# EasyEDA Pro project ProPrj_有源带通滤波器_2025-07-17.epro

# Schematic Schematic1
Board Name: Board1; Create Date: 2025-07-17; Page Name: P1; Project Name: 有源带通滤波器; Schematic Name: Schematic1; Update Date: 2025-07-17; Company: 嘉立创EDA; Page Size: A4; Version: V1.0
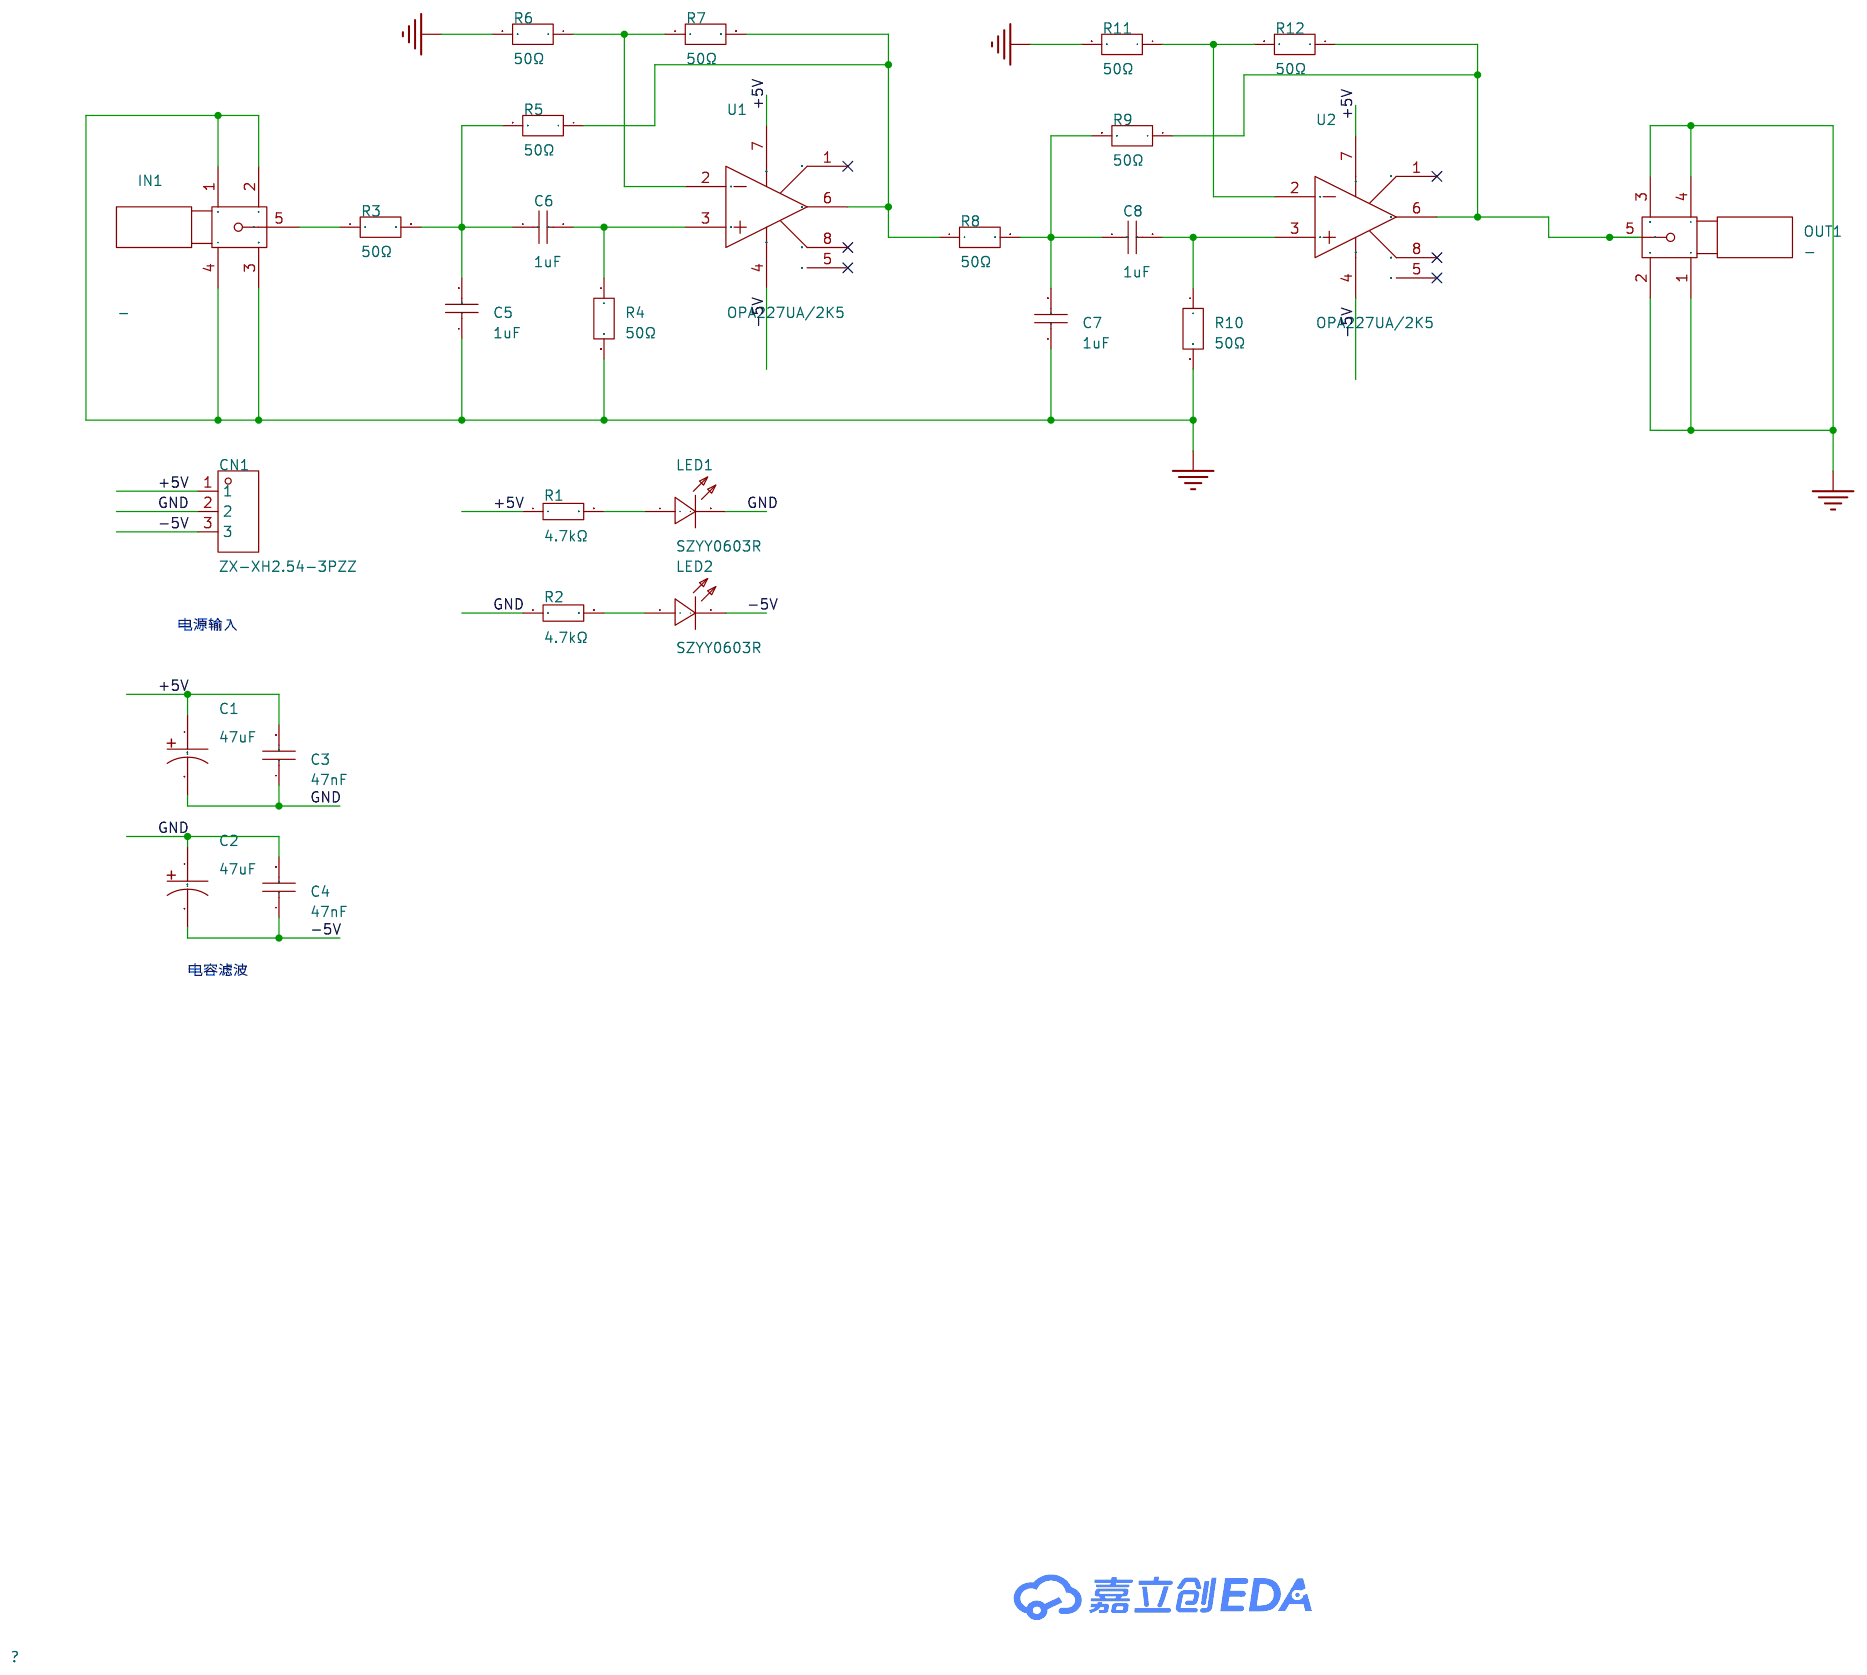
[diagram p0: schematic sheet]

## Parts
C1  47uF  [CAP-TH_BD5.0-P2.00-D0.8-FD]
C2  47uF  [CAP-TH_BD5.0-P2.00-D0.8-FD]
C3  47nF  [C0805]
C4  47nF  [C0805]
C5  1uF  [C0805]
C6  1uF  [C0805]
C7  1uF  [C0805]
C8  1uF  [C0805]
CN1  ZX-XH2.54-3PZZ  [CONN-TH_3P-P2.54_2501S-3P]
IN1  -  [SMA-SMD_BWSMA-KE-P001]
LED1  SZYY0603R  [LED0603-R-RD]
LED2  SZYY0603R  [LED0603-R-RD]
OUT1  -  [SMA-SMD_BWSMA-KE-P001]
R1  4.7kΩ  [R0805]
R2  4.7kΩ  [R0805]
R3  50Ω  [R0805]
R4  50Ω  [R0805]
R5  50Ω  [R0805]
R6  50Ω  [R0805]
R7  50Ω  [R0805]
R8  50Ω  [R0805]
R9  50Ω  [R0805]
R10  50Ω  [R0805]
R11  50Ω  [R0805]
R12  50Ω  [R0805]
U1  OPA227UA/2K5  [SOIC-8_L4.9-W3.9-P1.27-LS6.0-BL]
U2  OPA227UA/2K5  [SOIC-8_L4.9-W3.9-P1.27-LS6.0-BL]

## Library data of the parts
C1 C2 = NXB25V47M5*11 2.5TP: 容值:47uF;精度:±20%;额定电压:25V;纹波电流:250mA@100kHz;等效串联电阻(ESR):300mΩ@100kHz;; LCSC Part Name: 47uF ±20% 25V; Supplier Part: C371230; Manufacturer: SAMYOUNG(韩国三莹); Supplier Footprint: 插件,D5xL11mm; JLCPCB Part Class: 扩展库; Datasheet: https://atta.szlcsc.com/upload/public/pdf/source/20190227/C371244_FA85FFEFC2961227CF12E3CCE8C34A7D.pdf; Supplier: LCSC; Tolerance: ±20%; Voltage Rating: 25V; Ripple Current: 250mA@100kHz; Equivalent Series Resistance(ESR): 300mΩ@100kHz; Pin Spacing: 2mm; Diameter: 5mm; Height - Seated (Max): 11mm; Lifetime: 2000hrs@105℃; Operating Temperature: -40℃~+105℃
C3 C4 = CL21B473KBCNNNC: 容值:47nF;精度:±10%;额定电压:50V;材质(温度系数):X7R;; LCSC Part Name: 47nF ±10% 50V; Supplier Part: C53134; Manufacturer: SAMSUNG(三星); Supplier Footprint: 0805; JLCPCB Part Class: 基础库; Datasheet: https://atta.szlcsc.com/upload/public/pdf/source/20160218/1457707763339.pdf; Supplier: LCSC; Tolerance: ±10%; Voltage Rated: 50V; Temperature Coefficient: X7R
C5-C8 = CL21B105KBFNNNE: 容值:1uF;精度:±10%;额定电压:50V;材质(温度系数):X7R;; LCSC Part Name: 1uF ±10% 50V; Supplier Part: C28323; Manufacturer: SAMSUNG(三星); Supplier Footprint: 0805; JLCPCB Part Class: 基础库; Datasheet: https://atta.szlcsc.com/upload/public/pdf/source/20160218/1457707763339.pdf; Supplier: LCSC; Tolerance: ±10%; Voltage Rated: 50V; Temperature Coefficient: X7R
CN1 = ZX-XH2.54-3PZZ: 插针结构:1x3P;间距:2.5mm;安装方式:直插;参考系列:XH;总PIN数:3P;排数:1;每排PIN数:3;行距:-;额定电流:3A;触头材质:黄铜;触头镀层:锡;工作温度范围:-25℃~+85℃;; LCSC Part Name: 1x3P 间距:2.5mm 直插 系列:XH; Supplier Part: C7429633; Manufacturer: Megastar(兆星); Supplier Footprint: 插件,P=2.5mm; JLCPCB Part Class: 扩展库; Datasheet: https://atta.szlcsc.com/upload/public/pdf/source/20230619/AE17037A2CFDBE8D9CBA775D61AD0A84.pdf; Supplier: LCSC; Pins Structure: 1x3P; Pitch: 2.5mm; Mounting Type: 直插; Reference Series: XH; Number of Pins: 3P; Number of Rows: 1; Number of PINs Per Row: 3; Rated Current: 3A; Contact Material: 黄铜; Contact Plating: 锡; Operating Temperature: -25℃~+85℃; Rated Voltage (Max): 250V; Plastic Material: PA66; Flame Retardant Rating: UL94V-0; Color: 白色; Z-Height of the Board: 7mm; X-Length of Bottom Edge on Board (Spacing Line): 10mm; Y-Width of Bottom Edge on Board: 5.9mm
IN1 OUT1 = BWSMA-KE-P001: 连接器类型:板端;接口类型:内孔;端口数量:1;接口直径:5.2mm;接口长度/高度:-;频率:-;射频系列:SMA;阻抗:50Ω;样式:偏脚;工作温度:-;; LCSC Part Name: 内孔 SMA 偏脚; Supplier Part: C496550; Manufacturer: BAT WIRELESS(蝙蝠无线); Supplier Footprint: SMD; JLCPCB Part Class: 扩展库; Datasheet: https://atta.szlcsc.com/upload/public/pdf/source/20240320/28FD502871C976DFF213ABFCF2A0ED51.pdf; Supplier: LCSC; Connector Type: 板端; Interface: 内孔; Number of Ports: 1; Interface Diameter: 5.2mm; RF Series: SMA; Impedance: 50Ω; Style: 偏脚
LED1 LED2 = SZYY0603R: 发光颜色:红色;功率:40mW;正向电流:20mA;主波长:615nm~630nm;二极管配置:-;透镜颜色:无色透明透镜;色温:-;发光角度:120°;载带方式:-;工作温度:-40℃~+85℃;; LCSC Part Name: 红灯; Supplier Part: C434419; Manufacturer: yongyu(永裕光电); Supplier Footprint: 0603; JLCPCB Part Class: 扩展库; Datasheet: https://atta.szlcsc.com/upload/public/pdf/source/20191204/C434419_0B955C1F73FF88449D9A795B6FF49070.pdf; Supplier: LCSC; Emitted Color: 红色; Power Dissipation: 40mW; Forward Current: 20mA; Dominant Wavelength: 615nm~630nm; Peak Wavelength: 645nm; Lens Color: 无色透明透镜; Viewing Angle: 120°; Operating Temperature: -40℃~+85℃
R1 R2 = 0805W8F4701T5E: 电阻类型:厚膜电阻;阻值:4.7kΩ;精度:±1%;功率:125mW;最大工作电压:150V;温度系数:±100ppm/℃;; LCSC Part Name: 4.7kΩ ±1% 125mW 厚膜电阻; Supplier Part: C17673; Manufacturer: UNI-ROYAL(厚声); Supplier Footprint: 0805; JLCPCB Part Class: 基础库; Datasheet: https://atta.szlcsc.com/upload/public/pdf/source/20200306/C422600_1E6D84923E4A46A82E41ADD87F860B5C.pdf; Supplier: LCSC; Type: 厚膜电阻; Tolerance: ±1%; Power(Watts): 125mW; Overload Voltage (Max): 150V; Temperature Coefficient: ±100ppm/℃; Operating Temperature Range: -55℃~+155℃
R3-R12 = TD05G50R0BT: 电阻类型:薄膜电阻;阻值:50Ω;精度:±0.1%;功率:100mW;温度系数:±25ppm/℃;; LCSC Part Name: 薄膜电阻 50Ω ±0.1% 100mW; Supplier Part: C5355206; Manufacturer: FH(风华); Supplier Footprint: 0805; JLCPCB Part Class: 扩展库; Datasheet: https://atta.szlcsc.com/upload/public/pdf/source/20220726/97950D08E3EA8CC4F1F63A0C564F66E4.pdf; Supplier: LCSC; Type: 薄膜电阻; Tolerance: ±0.1%; Power(Watts): 100mW; Temperature Coefficient: ±25ppm/℃
U1 U2 = OPA227UA/2K5: 放大器数:单路;增益带宽积(GBP):8MHz;输入偏置电流(Ib):2.5nA;压摆率(SR):2.3V/us;轨到轨:-;; Supplier Part: C456278; Manufacturer: TI(德州仪器); Supplier Footprint: SOIC-8; JLCPCB Part Class: 扩展库; Datasheet: https://www.ti.com/cn/lit/gpn/opa227; Supplier: LCSC; Number of Channels: 单路; Gain Bandwidth Product: 8MHz; Ib - Input Bias Current: 2.5nA; Slew Rate: 2.3V/us; Output Current: 45mA; Operating Temperature: -40℃~+85℃

## Nets
+5V: C1.1 C3.2 CN1.1 R1.1 U1.7(VCC) U2.7(VCC)
-5V: C2.2 C4.1 CN1.3 LED2.2(-) U1.4(VSS) U2.4(VSS)
GND: C1.2 C2.1 C3.1 C4.2 C5.1 C7.1 CN1.2 IN1.1 IN1.2 IN1.3 IN1.4 LED1.2(-) OUT1.1 OUT1.2 OUT1.3 OUT1.4 R2.1 R4.2 R6.2 R10.2 R11.2
$1N803: C5.2 C6.1 R3.2 R5.2
$1N814: LED1.1(+) R1.2
$1N823: LED2.1(+) R2.2
$1N1510: C7.2 C8.1 R8.2 R9.2
Net-(C6-2): C6.2 R4.1 U1.3(VIN+)
Net-(C8-2): C8.2 R10.1 U2.3(VIN+)
Net-(IN1-5): IN1.5 R3.1
Net-(OUT1-5): OUT1.5 R9.1 R12.1 U2.6(OUT)
Net-(R5-1): R5.1 R7.2 R8.1 U1.6(OUT)
Net-(R6-1): R6.1 R7.1 U1.2(VIN-)
Net-(R11-1): R11.1 R12.2 U2.2(VIN-)

Not connected (* = marked no-connect by the designer): U1 1(TRIM)* 5(NC)* 8(TRIM)*; U2 1(TRIM)* 5(NC)* 8(TRIM)*

## Notes on the sheet
- 电源输入
- 电容滤波

# Board PCB1
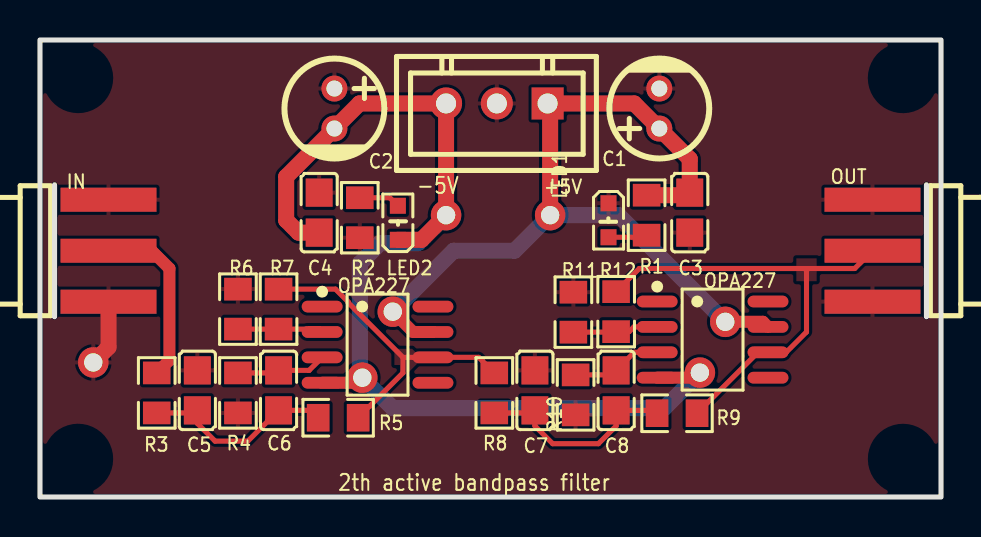
[diagram p1: board, top side]
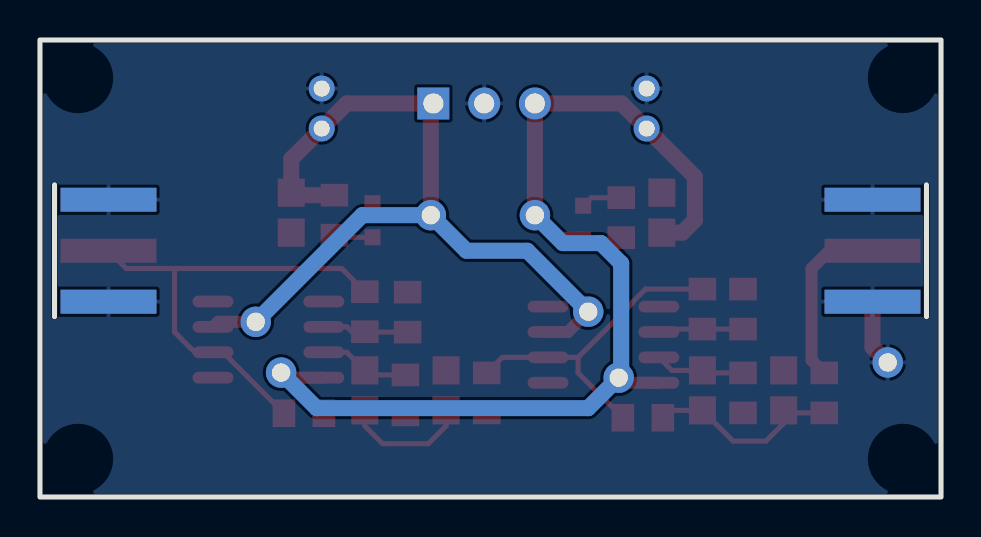
[diagram p2: board, bottom side, seen from below]

Outline 45.09 x 22.86 mm; copper layers: Top Layer, Bottom Layer. Coordinates in mm from the lower left corner of the outline.
Outline path: rectangle 0,22.86 45.09,0
Stack: Top Layer 0.035mm / Dielectric1 1.51mm FR4 er 4.5 / Bottom Layer 0.035mm

## Design rules (mm)
template: JLCPCB Capability(Two Layers Board)
spacing copperThickness1oz (default): track to track 0.102, other pairs 0.152 to 0.3
spacing copperThickness2oz: track to track 0.203, other pairs 0.152 to 0.3
track width copperThickness1oz (default): min 0.127, default 0.254, max 2.54
track width copperThickness2oz: min 0.203, default 0.254, max 2.54
differential pair differentialPair (default): width min 0.127, default 0.254, max 2.54; gap min 0.152, default 0.152
via viaSize (default): diameter min 0.5, default 0.61, max 10; hole min 0.3, default 0.305, max 6.3

## Placement (name value [footprint] x y rotation side)
 OPA227  OPA227UA/2K5  [SOIC-8_L4.9-W3.9-P1.27-LS6.0-BL]  16.89 7.62 270 top
+5V  ZX-XH2.54-3PZZ  [CONN-TH_3P-P2.54_2501S-3P]  22.86 19.69 180 top
C1  47uF  [CAP-TH_BD5.0-P2.00-D0.8-FD]  30.99 19.43 90 top
C2  47uF  [CAP-TH_BD5.0-P2.00-D0.8-FD]  14.73 19.43 270 top
C3  47nF  [C0805]  32.51 14.22 90 top
C4  47nF  [C0805]  13.97 14.22 90 top
C5  1uF  [C0805]  7.87 5.33 270 top
C6  1uF  [C0805]  11.94 5.33 90 top
C7  1uF  [C0805]  24.77 5.33 270 top
C8  1uF  [C0805]  28.83 5.33 90 top
IN  -  [SMA-SMD_BWSMA-KE-P001]  3.43 12.32 180 top
LED1  SZYY0603R  [LED0603-R-RD]  28.45 13.84 270 top
LED2  SZYY0603R  [LED0603-R-RD]  17.91 13.72 90 top
NOREF  -  [Pad_e50]  20.32 14.1 0 top
NOREF#2  -  [Pad_e154]  34.29 8.76 0 top
NOREF#3  -  [Pad_e137]  17.65 9.27 0 top
NOREF#4  -  [Pad_e52]  25.53 14.1 0 top
NOREF#5  -  [Pad_e225]  2.67 6.73 0 top
NOREF#6  -  [Pad_e136]  16.13 5.97 0 top
NOREF#7  -  [Pad_e148]  33.02 6.22 0 top
OPA227  OPA227UA/2K5  [SOIC-8_L4.9-W3.9-P1.27-LS6.0-BL]  33.66 7.87 270 top
OUT  -  [SMA-SMD_BWSMA-KE-P001]  41.66 12.32 0 top
R1  4.7kΩ  [R0805]  30.35 14.1 270 top
R2  4.7kΩ  [R0805]  16 13.97 90 top
R3  50Ω  [R0805]  5.84 5.21 270 top
R4  50Ω  [R0805]  9.91 5.21 270 top
R5  50Ω  [R0805]  14.92 3.97 180 top
R6  50Ω  [R0805]  9.91 9.4 90 top
R7  50Ω  [R0805]  11.94 9.4 270 top
R8  50Ω  [R0805]  22.73 5.21 270 top
R9  50Ω  [R0805]  31.88 4.19 180 top
R10  50Ω  [R0805]  26.8 5.11 270 top
R11  50Ω  [R0805]  26.69 9.25 90 top
R12  50Ω  [R0805]  28.83 9.27 270 top

## Footprints (pads in the part's own frame, mm; a bottom-side part is the same pattern mirrored in y, then rotated)
C0805
  rect 1.41x1.35 smd: 1(-1,0) 2(1,0)
CAP-TH_BD5.0-P2.00-D0.8-FD
  round 1.3 hole 0.8: 1(-1,0) 2(1,0)
CONN-TH_3P-P2.54_2501S-3P
  rect 1.6x1.6 hole 1: 1(-2.54,0)
  round 1.6 hole 1: 2(0,0) 3(2.54,0)
LED0603-R-RD
  rect 0.8x0.8 smd: 1(0.851,0) 2(-0.851,0)
Pad_e50
  round 1.524 hole 0.914: 1(0,0)
Pad_e52
  round 1.524 hole 0.914: 1(0,0)
Pad_e136
  round 1.524 hole 0.914: 1(0,0)
Pad_e137
  round 1.524 hole 0.914: 1(0,0)
Pad_e148
  round 1.524 hole 0.914: 1(0,0)
Pad_e154
  round 1.524 hole 0.914: 1(0,0)
Pad_e225
  round 1.524 hole 0.914: 1(0,0)
R0805
  rect 1.133x1.377 smd: 1(-1,0) 2(1,0)
SMA-SMD_BWSMA-KE-P001
  rect 4.8x1.2 smd: 1(0,-2.55) 2(0,2.55) 5(0,0)
  rect 4.8x1.2 smd far side: 3(0,2.55) 4(0,-2.55)
SOIC-8_L4.9-W3.9-P1.27-LS6.0-BL
  oval 0.588x2.045 smd: 1(-1.905,-2.772) 2(-0.635,-2.772) 3(0.635,-2.772) 4(1.905,-2.772) 5(1.905,2.772) 6(0.635,2.772) 7(-0.635,2.772) 8(-1.905,2.772)

## Nets
+5V:  OPA227.7 +5V.1 C1.1 C3.2 NOREF#2.1 NOREF#3.1 NOREF#4.1 OPA227.7 R1.1
-5V:  OPA227.4 +5V.3 C2.2 C4.1 LED2.2 NOREF.1 NOREF#6.1 NOREF#7.1 OPA227.4
GND: +5V.2 C1.2 C2.1 C3.1 C4.2 C5.1 C7.1 IN.1 IN.2 IN.3 IN.4 LED1.2 NOREF#5.1 OUT.1 OUT.2 OUT.3 OUT.4 R2.1 R4.2 R6.2 R10.2 R11.2
$1N800: IN.5 R3.1
$1N803: C5.2 C6.1 R3.2 R5.2
$1N814: LED1.1 R1.2
$1N823: LED2.1 R2.2
$1N855:  OPA227.3 C6.2 R4.1
$1N962: OPA227.6 OUT.5 R9.1 R12.1
$1N1081:  OPA227.2 R6.1 R7.2
$1N1424: C8.2 OPA227.3 R10.1
$1N1436: OPA227.2 R11.1 R12.2
$1N1510: C7.2 C8.1 R8.2 R9.2
$1N1533:  OPA227.6 R5.1 R7.1 R8.1

Pads without a net:  OPA227 1 5 8; OPA227 1 5 8

## Routing (per net, layer and track width the routed paths; a pad name or vN(x,y) marks a point on that pad's centre or on a via; arc(x,y) is an arc through that point)
+5V: length 43.3
  Top Layer w0.6: OPA227.7 36.17,8.76 NOREF#2.1 ;  OPA227.7 18.67,8.25 NOREF#3.1
  Top Layer w0.8: NOREF#4.1 25.53,19.56 +5V.1 29.73,19.69 C1.1 32.51,16.91 C3.2 32.39,15.1 R1.1
  Bottom Layer w0.8: NOREF#2.1 28.96,14.1 NOREF#4.1 23.75,12.32 20.7,12.32 NOREF#3.1
-5V: length 55.8
  Top Layer w0.6: NOREF#6.1 15.88,5.72  OPA227.4 ; NOREF#7.1 32.77,5.97 OPA227.4
  Top Layer w0.8: LED2.2 19.09,12.86 NOREF.1 +5V.3 15.99,19.69 C2.2 12.32,16.02 12.32,13.84 12.94,13.22 C4.1
  Bottom Layer w0.8: NOREF.1 18.92,12.7 17.02,12.7 16,11.68 16,6.1 NOREF#6.1 17.65,4.44 31.24,4.44 NOREF#7.1
GND: length 3.5
  Top Layer w0.254: 24.77,6.14 C7.1
  Top Layer w0.8: NOREF#5.1 3.43,7.49 IN.2
$1N800: length 8.9
  Top Layer w0.6: R3.1 6.48,6.84 6.48,11.43 5.59,12.32 IN.5
$1N803: length 9.9
  Top Layer w0.254: R3.2 7.75,4.21 C5.2 7.87,3.68 8.76,2.79 10.4,2.79 C6.1 13.55,4.33 R5.2
$1N814: length 1.9
  Top Layer w0.254: R1.2 30.25,12.99 LED1.1
$1N823: length 2.1
  Top Layer w0.254: LED2.1 17.5,14.97 R2.2
$1N855: length 4.5
  Top Layer w0.254: R4.1 11.81,6.21 C6.2 13.47,6.33  OPA227.3
$1N962: length 24
  Top Layer w0.254: R9.1 35.93,7.24 37.34,7.24 38.35,8.25 38.35,11.42 38.34,11.43 ; 38.34,11.43 29.99,11.43 R12.1 ; 38.34,11.43 40.77,11.43 OUT.5
$1N1081: length 4.3
  Top Layer w0.254: R6.1 R7.2 13.98,8.4  OPA227.2
$1N1424: length 4.6
  Top Layer w0.254: R10.1 28.6,6.11 C8.2 29.73,7.24 30.88,7.24
$1N1436: length 4.3
  Top Layer w0.254: OPA227.2 29.72,8.51 29.48,8.27 R12.2 28.8,8.25 R11.1
$1N1510: length 10.5
  Top Layer w0.254: R8.2 24.64,4.21 C7.2 24.77,3.56 25.65,2.67 27.94,2.67 28.83,3.56 C8.1 30.73,4.33 R9.2
$1N1533: length 16.5
  Top Layer w0.254: R8.1 21.96,6.98  OPA227.6 18.16,6.98 ; 18.16,6.98 15.42,9.73 15.42,9.76 14.78,10.4 R7.1 ; 18.16,6.98 18.16,6.21 R5.1

## Copper pours and planes (outline as drawn; the poured copper is in the pictures)
GND on Top Layer: 0,22.86 45.09,22.86 45.09,0 0,0
GND on Bottom Layer: 0,22.86 45.09,22.86 45.09,0 0,0
$1N962 on Top Layer: 37.85,11.94 38.86,11.94 38.86,10.8 37.85,10.8
$1N1533 on Top Layer: 17.73,7.41 18.92,7.41 18.92,6.21 17.73,6.21

## Text on the board
Top Silkscreen Layer: 2th active bandpass filter | -5V
